# Altium schematic sheet Promless_Power.SchDoc: PROMless Power
size A; Organization: UCLA High Energy Physics; DocumentNumber: 18; Revision: 2.0; SheetNumber: 18; SheetTotal: 23; CurrentDate: 9/6/2018; ModifiedDate: 9/6/2018
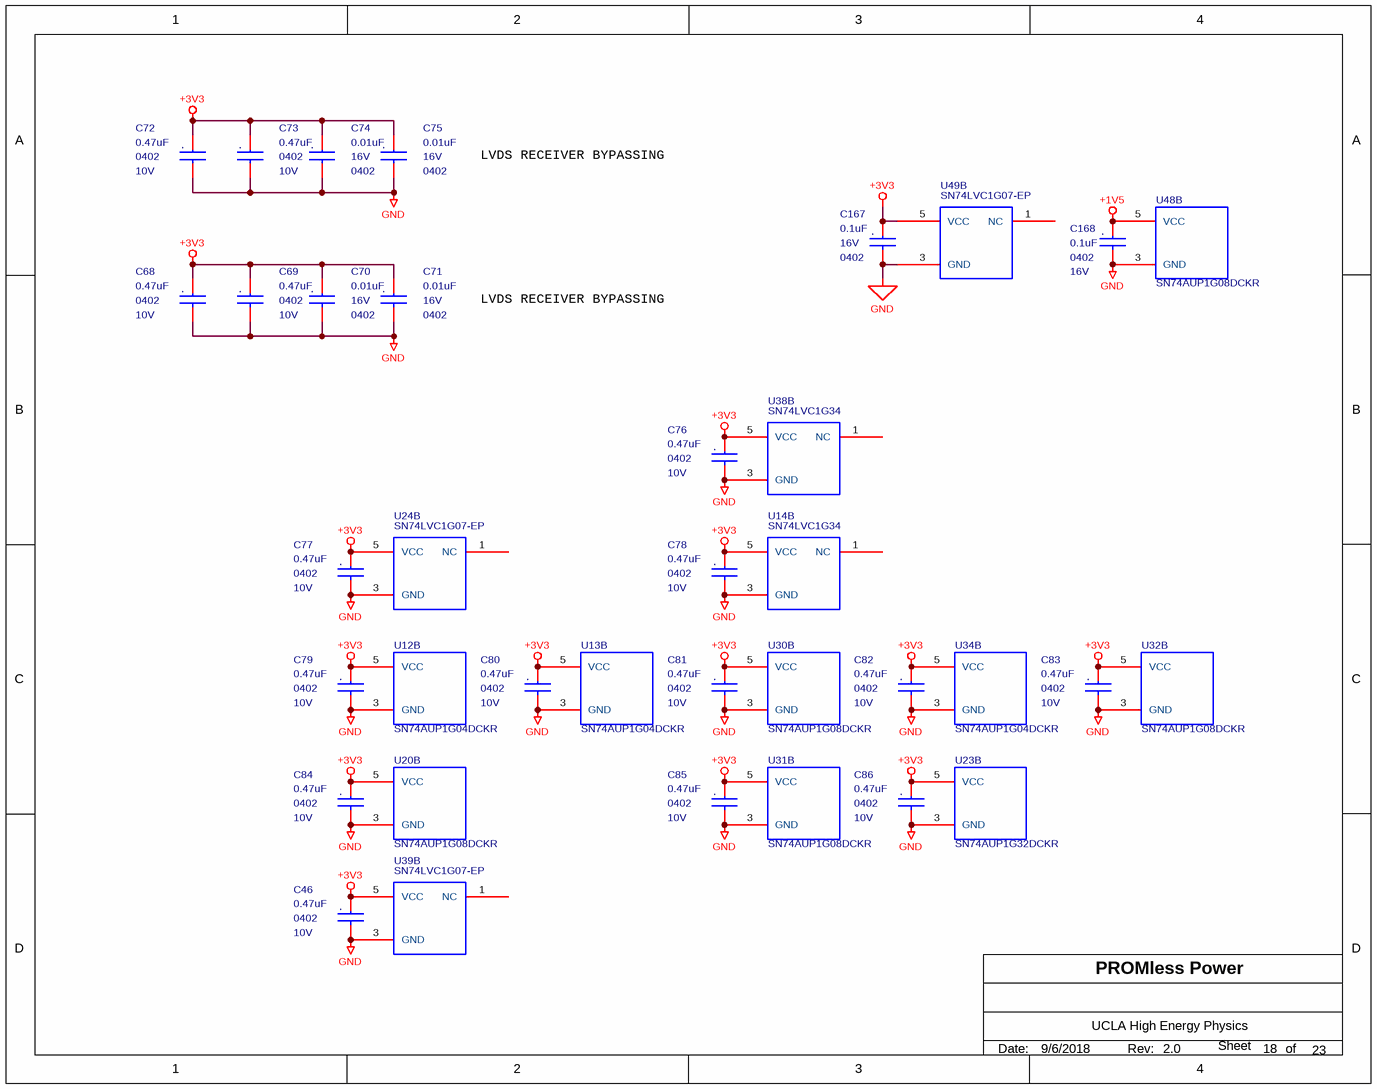
[diagram p0: Promless_Power.SchDoc]

## Parts
C46  0.47uF  Voltage - Rated: 10V  package: 0402  [MC_S6/SM/C_0402_IPC]
C68  0.47uF  Voltage - Rated: 10V  package: 0402  [MC_S6/SM/C_0402_IPC]
C69  0.47uF  Voltage - Rated: 10V  package: 0402  [MC_S6/SM/C_0402_IPC]
C70  0.01uF  Voltage - Rated: 16V  package: 0402  [MC_S6/SM/C_0402_IPC]
C71  0.01uF  Voltage - Rated: 16V  package: 0402  [MC_S6/SM/C_0402_IPC]
C72  0.47uF  Voltage - Rated: 10V  package: 0402  [MC_S6/SM/C_0402_IPC]
C73  0.47uF  Voltage - Rated: 10V  package: 0402  [MC_S6/SM/C_0402_IPC]
C74  0.01uF  Voltage - Rated: 16V  package: 0402  [MC_S6/SM/C_0402_IPC]
C75  0.01uF  Voltage - Rated: 16V  package: 0402  [MC_S6/SM/C_0402_IPC]
C76  0.47uF  Voltage - Rated: 10V  package: 0402  [MC_S6/SM/C_0402_IPC]
C77  0.47uF  Voltage - Rated: 10V  package: 0402  [MC_S6/SM/C_0402_IPC]
C78  0.47uF  Voltage - Rated: 10V  package: 0402  [MC_S6/SM/C_0402_IPC]
C79  0.47uF  Voltage - Rated: 10V  package: 0402  [MC_S6/SM/C_0402_IPC]
C80  0.47uF  Voltage - Rated: 10V  package: 0402  [MC_S6/SM/C_0402_IPC]
C81  0.47uF  Voltage - Rated: 10V  package: 0402  [MC_S6/SM/C_0402_IPC]
C82  0.47uF  Voltage - Rated: 10V  package: 0402  [MC_S6/SM/C_0402_IPC]
C83  0.47uF  Voltage - Rated: 10V  package: 0402  [MC_S6/SM/C_0402_IPC]
C84  0.47uF  Voltage - Rated: 10V  package: 0402  [MC_S6/SM/C_0402_IPC]
C85  0.47uF  Voltage - Rated: 10V  package: 0402  [MC_S6/SM/C_0402_IPC]
C86  0.47uF  Voltage - Rated: 10V  package: 0402  [MC_S6/SM/C_0402_IPC]
C167  0.1uF  package: 0402  Voltage - Rated: 16V  [MC_S6/SM/C_0402_IPC]
C168  0.1uF  package: 0402  Voltage - Rated: 16V  [MC_S6/SM/C_0402_IPC]
U12  SN74AUP1G04DCKR  [MC_S6/SM/SOT_SC70_DCK5]  (part B of 2)
U13  SN74AUP1G04DCKR  [MC_S6/SM/SOT_SC70_DCK5]  (part B of 2)
U14  SN74LVC1G34  [MC_S6/SM/SOT_553_DRL5]  (part B of 2)
U20  SN74AUP1G08DCKR  [MC_S6/SM/SOT_SC70_DCK5]  (part B of 2)
U23  SN74AUP1G32DCKR  [MC_S6/SM/SOT_SC70_DCK5]  (part B of 2)
U24  SN74LVC1G07-EP  [SOT353-1]  (part B of 2)
U30  SN74AUP1G08DCKR  [MC_S6/SM/SOT_SC70_DCK5]  (part B of 2)
U31  SN74AUP1G08DCKR  [MC_S6/SM/SOT_SC70_DCK5]  (part B of 2)
U32  SN74AUP1G08DCKR  [MC_S6/SM/SOT_SC70_DCK5]  (part B of 2)
U34  SN74AUP1G04DCKR  [MC_S6/SM/SOT_SC70_DCK5]  (part B of 2)
U38  SN74LVC1G34  [MC_S6/SM/SOT_553_DRL5]  (part B of 2)
U39  SN74LVC1G07-EP  [SOT353-1]  (part B of 2)
U48  SN74AUP1G08DCKR  [MC_S6/SM/SOT_SC70_DCK5]  (part B of 2)
U49  SN74LVC1G07-EP  [SOT353-1]  (part B of 2)

## Nets
+1V5: C168.1 U48.5(VCC)
+3V3: C46.1 C68.1 C69.1 C70.1 C71.1 C72.1 C73.1 C74.1 C75.1 C76.1 C77.1 C78.1 C79.1 C80.1 C81.1 C82.1 C83.1 C84.1 C85.1 C86.1 C167.1 U12.5(VCC) U13.5(VCC) U14.5(VCC) U20.5(VCC) U23.5(VCC) U24.5(VCC) U30.5(VCC) U31.5(VCC) U32.5(VCC) U34.5(VCC) U38.5(VCC) U39.5(VCC) U49.5(VCC)
GND: C46.2 C68.2 C69.2 C70.2 C71.2 C72.2 C73.2 C74.2 C75.2 C76.2 C77.2 C78.2 C79.2 C80.2 C81.2 C82.2 C83.2 C84.2 C85.2 C86.2 C167.2 C168.2 U12.3(GND) U13.3(GND) U14.3(GND) U20.3(GND) U23.3(GND) U24.3(GND) U30.3(GND) U31.3(GND) U32.3(GND) U34.3(GND) U38.3(GND) U39.3(GND) U48.3(GND) U49.3(GND)

Not connected (* = marked no-connect by the designer): U14 1(NC); U24 1(NC); U38 1(NC); U39 1(NC); U49 1(NC)

## Notes on the sheet
- LVDS RECEIVER BYPASSING
- Date:
- Rev:
- of
- Sheet
- (in symbol C0402C103K4RACTU) .
- (in symbol C0402C104K4RACTU) .
- (in symbol GRM155R61A474KE15D) .

## Library data of the parts
C46 C68 C69 C72 C73 C76-C86 = GRM155R61A474KE15D: CAP CER 0.47UF 10V X5R 0402; Manufacturer: Murata Electronics North America; Capacitance: 0.47µF; Tolerance: ±10%; Supplier 1: Digi-Key; Manufacturer Part Number: GRM155R61A474KE15D; RoHS: RoHS Compliant; Category: Capacitors; Stock 1: 506743; Pricing 1: 1=0.1, 10=0.064, 50=0.0344, 100=0.0292, 250=0.02384, 500=0.0204, 1000=0.0159, 5000=0.01325 (USD); Packaging: Cut Tape (CT); Part Status: Active; Operating Temperature: -55°C ~ 85°C; Features: -; Ratings: -; Applications: General Purpose; Mounting Type: Surface Mount, MLCC; Package / Case: 0402 (1005 Metric); Size / Dimension: 0.039" L x 0.020" W (1.00mm x 0.50mm); Height - Seated (Max): -; Thickness (Max): 0.022" (0.55mm); Lead Spacing: -; Lead Style: -; ComponentLink1URL: http://www.murata.com/~/media/webrenewal/support/library/catalog/products/capacitor/mlcc/c02e.pdf; ComponentLink1Description: http://www.murata.com/~/media/webrenewal/support/library/catalog/products/capacitor/mlcc/c02e.pdf; Supplier 2: Digi-Key; Stock 2: 506743; Pricing 2: 1=0.1, 10=0.064, 50=0.0344, 100=0.0292, 250=0.02384, 500=0.0204, 1000=0.0159, 5000=0.01325 (USD); Supplier Part Number 1: 490-3264-1-ND; Supplier Part Number 2: 490-3264-6-ND; Temperature Coefficient: X5R
C70 C71 C74 C75 = C0402C103K4RACTU: CAP CER 10nF 16V X7R 0402; Manufacturer: KEMET; Capacitance: 10000pF; Tolerance: ±10%; Supplier 1: Digi-Key; Manufacturer Part Number: C0402C103K4RACTU; RoHS: RoHS Compliant; Category: Capacitors; Stock 1: 605739; Pricing 1: 1=0.1, 10=0.02, 25=0.0144, 50=0.0108, 100=0.0088, 250=0.00732, 500=0.00626, 1000=0.00492, 5000=0.00412 (USD); Packaging: Cut Tape (CT); Part Status: Active; Temperature Coefficient: X7R; Operating Temperature: -55°C ~ 125°C; Features: -; Ratings: -; Applications: General Purpose; Failure Rate: -; Mounting Type: Surface Mount, MLCC; Package / Case: 0402 (1005 Metric); Size / Dimension: 0.039" L x 0.020" W (1.00mm x 0.50mm); Height - Seated (Max): -; Thickness (Max): 0.022" (0.55mm); Lead Spacing: -; Lead Style: -; ComponentLink1URL: http://www.kemet.com/docfinder?Partnumber=C0402C103K4RACTU; ComponentLink1Description: http://www.kemet.com/docfinder?Partnumber=C0402C103K4RACTU; Supplier 2: Digi-Key; Stock 2: 605739; Pricing 2: 1=0.1, 10=0.02, 25=0.0144, 50=0.0108, 100=0.0088, 250=0.00732, 500=0.00626, 1000=0.00492, 5000=0.00412 (USD); Supplier Part Number 1: 399-1038-1-ND; Supplier Part Number 2: 399-1038-6-ND
C167 C168 = C0402C104K4RACTU: CAP CER 0.1UF 16V X7R 0402; Manufacturer: KEMET; Capacitance: 0.10µF; Tolerance: ±10%; Supplier 1: Digi-Key; Manufacturer Part Number: C0402C104K4RACTU; RoHS: RoHS Compliant; Category: Capacitors; Stock 1: 3565698; Pricing 1: 1=0.11, 10=0.078, 25=0.0568, 50=0.0442, 100=0.0365, 250=0.03024, 500=0.02562, 1000=0.02121, 5000=0.01806 (USD); Packaging: Cut Tape (CT); Part Status: Active; Operating Temperature: -55°C ~ 125°C; Features: -; Ratings: -; Applications: General Purpose; Failure Rate: -; Mounting Type: Surface Mount, MLCC; Package / Case: 0402 (1005 Metric); Size / Dimension: 0.039" L x 0.020" W (1.00mm x 0.50mm); Height - Seated (Max): -; Thickness (Max): 0.022" (0.55mm); Lead Spacing: -; Lead Style: -; ComponentLink1URL: http://www.kemet.com/docfinder?Partnumber=C0402C104K4RACTU; ComponentLink1Description: http://www.kemet.com/docfinder?Partnumber=C0402C104K4RACTU; Supplier 2: Digi-Key; Stock 2: 3565998; Pricing 2: 1=0.11, 10=0.078, 25=0.0568, 50=0.0442, 100=0.0365, 250=0.03024, 500=0.02562, 1000=0.02121, 5000=0.01806 (USD); Supplier Part Number 1: 399-3521-1-ND; Supplier Part Number 2: 399-3521-6-ND; Temperature Coefficient: X7R
U12 U13 U34 = SN74AUP1G04DCKR: IC INVERTER LP 5TSSOP; Manufacturer: Texas Instruments; Number of Inputs: 1; Voltage - Supply: 0.8 V ~ 3.6 V; Current - Output High, Low: 4mA, 4mA; Logic Level - Low: 0.7 V ~ 0.9 V; Logic Level - High: 1.6 V ~ 2 V; Max Propagation Delay @ V, Max CL: 5.4ns @ 3.3V, 30pF; Supplier 1: Digi-Key; Manufacturer Part Number: SN74AUP1G04DCKR; RoHS: RoHS Compliant; Category: Integrated Circuits (ICs); Stock 1: 7270; Pricing 1: 1=0.48, 10=0.364, 100=0.227, 500=0.15532, 1000=0.11948 (USD); Packaging: Digi-Reel®; Part Status: Active; Logic Type: Inverter; Features: -; Operating Temperature: -40°C ~ 85°C; Mounting Type: Surface Mount; Supplier Device Package: SC-70-5; Package / Case: 5-TSSOP, SC-70-5, SOT-353; ComponentLink1URL: http://www.ti.com/lit/ds/symlink/sn74aup1g04.pdf; ComponentLink1Description: http://www.ti.com/lit/ds/symlink/sn74aup1g04.pdf; Supplier 2: Digi-Key; Stock 2: 7270; Pricing 2: 1=0.48, 10=0.364, 100=0.227, 500=0.15532, 1000=0.11948 (USD); Supplier Part Number 1: 296-19072-6-ND; Supplier Part Number 2: 296-19072-1-ND
U14 U38 = SN74LVC1G34DRLR: IC BUFFER NON-INVERT SOT5; Manufacturer: Texas Instruments; mfgr: Texas Inst; mfgr_foot: DRL; COMPROT: 270; COMPGROUP: 0; COMPSIDE: TOP; Logic Type: Buffer, Non-Inverting; Number of Bits per Element: 1; Output Type: Push-Pull; Current - Output High, Low: 32mA, 32mA; Voltage - Supply: 1.65 V ~ 5.5 V; mfgr_id: SN74LVC1G34DRLR; Package: 99; Supplier 1: Digi-Key; Manufacturer Part Number: SN74LVC1G34DRLR; RoHS: RoHS Compliant; Category: Integrated Circuits (ICs); Stock 1: 1633; Pricing 1: 1=0.48, 10=0.387, 100=0.2637, 500=0.19776, 1000=0.14832 (USD); Packaging: Cut Tape (CT); Part Status: Active; Input Type: -; Operating Temperature: -40°C ~ 125°C (TA); Mounting Type: Surface Mount; Package / Case: SOT-553; Supplier Device Package: SOT-5; ComponentLink1URL: http://www.ti.com/lit/ds/symlink/sn74lvc1g34.pdf; ComponentLink1Description: http://www.ti.com/lit/ds/symlink/sn74lvc1g34.pdf; Supplier 2: Digi-Key; Stock 2: 1633; Pricing 2: 1=0.48, 10=0.387, 100=0.2637, 500=0.19776, 1000=0.14832 (USD); Supplier Part Number 1: 296-18017-1-ND; Supplier Part Number 2: 296-18017-6-ND
U20 U30-U32 U48 = SN74AUP1G08DCKR: IC GATE AND 1CH 2-INP 5-TSSOP; Manufacturer: Texas Instruments; Manufacturer Part Number: SN74AUP1G08DCKT; Logic Type: AND Gate; Number of Inputs: 2; Voltage - Supply: 0.8 V ~ 3.6 V; Current - Output High, Low: 4mA, 4mA; Logic Level - Low: 0.7 V ~ 0.9 V; Logic Level - High: 1.6 V ~ 2 V; Max Propagation Delay @ V, Max CL: 6.2ns @ 3.3V, 30pF; Supplier 1: Digi-Key; RoHS: RoHS Compliant; Category: Integrated Circuits (ICs); Stock 1: 7470; Pricing 1: 1=0.8, 10=0.707, 100=0.542 (USD); Packaging: Cut Tape (CT); Part Status: Active; Features: -; Operating Temperature: -40°C ~ 85°C; Mounting Type: Surface Mount; Supplier Device Package: SC-70-5; Package / Case: 5-TSSOP, SC-70-5, SOT-353; ComponentLink1URL: http://www.ti.com/lit/ds/symlink/sn74aup1g08.pdf; ComponentLink1Description: http://www.ti.com/lit/ds/symlink/sn74aup1g08.pdf; Supplier 2: Digi-Key; Stock 2: 7470; Pricing 2: 1=0.8, 10=0.707, 100=0.542 (USD); Supplier Part Number 1: 296-32258-1-ND; Supplier Part Number 2: 296-32258-6-ND
U23 = SN74AUP1G32DCKR: IC GATE OR 1CH 2-INP 5-TSSOP; Manufacturer: Texas Instruments; Manufacturer Part Number: SN74AUP1G32DCKT; Logic Type: OR Gate; Number of Inputs: 2; Voltage - Supply: 0.8 V ~ 3.6 V; Current - Output High, Low: 4mA, 4mA; Logic Level - Low: 0.7 V ~ 0.9 V; Logic Level - High: 1.6 V ~ 2 V; Max Propagation Delay @ V, Max CL: 6.4ns @ 3.3V, 30pF; Supplier 1: Digi-Key; RoHS: RoHS Compliant; Category: Integrated Circuits (ICs); Stock 1: 96; Pricing 1: 1=0.8, 10=0.707, 100=0.542 (USD); Packaging: Cut Tape (CT); Part Status: Active; Features: -; Operating Temperature: -40°C ~ 85°C; Mounting Type: Surface Mount; Supplier Device Package: SC-70-5; Package / Case: 5-TSSOP, SC-70-5, SOT-353; ComponentLink1URL: http://www.ti.com/lit/ds/symlink/sn74aup1g32.pdf; ComponentLink1Description: http://www.ti.com/lit/ds/symlink/sn74aup1g32.pdf; Supplier 2: Digi-Key; Stock 2: 96; Pricing 2: 1=0.8, 10=0.707, 100=0.542 (USD); Supplier Part Number 1: 296-32262-1-ND; Supplier Part Number 2: 296-32262-6-ND
U24 U39 U49 = SN74LVC1G07-EP: IC BUFF/DVR NON-INVERT Open Drain SC70-5; Manufacturer: Texas Instruments; mfgr_id: SN74LVC1G07MDCKREP; mfgr: Texas Inst; mfgr_foot: DCK; COMPROT: 270; COMPGROUP: 0; COMPSIDE: TOP; Logic Type: Buffer, Non-Inverting; Number of Bits per Element: 1; Current - Output High, Low: -, 32mA; Voltage - Supply: 1.65 V ~ 5.5 V; Package: 99; Supplier 1: Digi-Key; Manufacturer Part Number: SN74LVC1G07MDCKREP; RoHS: RoHS Compliant; Category: Integrated Circuits (ICs); Stock 1: 4252; Pricing 1: 1=0.81, 10=0.714, 100=0.5472, 500=0.4326, 1000=0.34608 (USD); Packaging: Cut Tape (CT); Part Status: Active; Input Type: -; Output Type: Open Drain; Operating Temperature: -55°C ~ 125°C (TA); Mounting Type: Surface Mount; Package / Case: 5-TSSOP, SC-70-5, SOT-353; Supplier Device Package: SC-70-5; ComponentLink1URL: http://www.ti.com/lit/ds/symlink/sn74lvc1g07-ep.pdf; ComponentLink1Description: http://www.ti.com/lit/ds/symlink/sn74lvc1g07-ep.pdf; Supplier 2: Digi-Key; Stock 2: 4252; Pricing 2: 1=0.81, 10=0.714, 100=0.5472, 500=0.4326, 1000=0.34608 (USD); Supplier Part Number 1: 296-22343-1-ND; Supplier Part Number 2: 296-22343-6-ND